# Altium schematic sheet Sheet6.SchDoc
size A4; SheetNumber: 6; SheetTotal: 8; SPICEModelCacheGOSHTQAV: <root> / <DocumentId>GOSHTQAV</DocumentId> / <CacheFrame Number="0"> / <Model Name="max8815a_max8815a_f1" Kind="CKT"> / <Text>**************** / .subckt MAX8815A_MAX8815A_F1 1 2 3 4 / F_MAX8815A_F1         3 4 VF_MAX8815A_F1 -1 / VF_MAX8815A_F1         1 2 0V / .ENDS MAX8815A_MAX8815A_F1</Text> / </Model> / <Model Name="max8815a" Kind="CKT"> / <Text>******************************************************************************* / * Copyright (C) Maxim Integrated Products, Inc., All Rights Reserved. / * / * Permission is hereby granted, free of charge, to any person obtaining a / * copy of this software and associated documentation files (the "Software"), / * to deal in the Software without restriction, including without limitation / * the rights to use, copy, modify, merge, publish, distribute, sublicense, / * and/or sell copies of the Software, and to permit persons to whom the / * Software is furnished to do so, subject to the following conditions: / * / * The above copyright notice and this permission notice shall be included / * in all copies or substantial portions of the Software. / * / * THE SOFTWARE IS PROVIDED "AS IS", WITHOUT WARRANTY OF ANY KIND, EXPRESS / * OR IMPLIED, INCLUDING BUT NOT LIMITED TO THE WARRANTIES OF / * MERCHANTABILITY, FITNESS FOR A PARTICULAR PURPOSE AND NONINFRINGEMENT. / * IN NO EVENT SHALL MAXIM INTEGRATED BE LIABLE FOR ANY CLAIM, DAMAGES / * OR OTHER LIABILITY, WHETHER IN AN ACTION OF CONTRACT, TORT OR OTHERWISE, / * ARISING FROM, OUT OF OR IN CONNECTION WITH THE SOFTWARE OR THE USE OR / * OTHER DEALINGS IN THE SOFTWARE. / * / * Except as contained in this notice, the name of Maxim Integrated / * Products, Inc. shall not be used except as stated in the Maxim Integrated / * Products, Inc. Branding Policy. / * / * The mere transfer of this software does not imply any licenses / * of trade secrets, proprietary technology, copyrights, patents, / * trademarks, maskwork rights, or any other form of intellectual / * property whatsoever. Maxim Integrated Products, Inc. retains all / * ownership rights. / *************************************************************** / * MAX8815A is a 30uA Quiescent Current Step-Up Converter with True Shutdown. / ************************************************************************ / .subckt MAX8815A  LX BATT ON GND FB OUTS SKIPB POUT LX1 POUT1 / *                 |   |   |   |   |   |   |    |    |   | / *                 |   |   |   |   |   |   |    |    |   | / *                 |   |   |   |   |   |   |    |    |   | / *                 |   |   |   |   |   |   |    |    |   | / *                 |   |   |   |   |   |   |    |    |   | / *                 |   |   |   |   |   |   |    |    |   | / *                 |   |   |   |   |   |   |    |    |   Converter Output / *                 |   |   |   |   |   |   |    |    | / *                 |   |   |   |   |   |   |    |    | / *                 |   |   |   |   |   |   |    |    Inductor Connection / *                 |   |   |   |   |   |   |    | / *                 |   |   |   |   |   |   |    | / *                 |   |   |   |   |   |   |    Converter Output / *                 |   |   |   |   |   |   | / *                 |   |   |   |   |   |   | / *                 |   |   |   |   |   |   PWM Mode Selection Input / *                 |   |   |   |   |   | / *                 |   |   |   |   |   | / *                 |   |   |   |   |   Power Bootstrapped Input / *                 |   |   |   |   | / *                 |   |   |   |   | / *                 |   |   |   |    Feedback Input. / *                 |   |   |   | / *                 |   |   |   | / *                 |   |   |   Ground / *                 |   |   | / *                 |   |   | / *                 |   |   Logic On/Off Input. / *                 |   | / *                 |   | / *                 |   Supply Voltage Input / *                 | / *                 | / *                 Inductor Connection / * / * / * Date of model creation: / *		 08/2009 / * / * / * Revision History: / * 		 Version 0 / *        Version 1 / * / * Recommendations: / *     	Use SIMETRIX (or SPICE 2G6; other simulators may require translation) / *     	For a quick, effective design, use a combination of: data sheet / * 	    specs, bench testing, and simulations with this macromodel / *       For Pspice Use .OPTIONS ITL4=30 for resolving convergence / * / * / * Supported: / *	    Heavy Load Switching  , Light Load Switching(Low) , Light Load Switching(High) , Start up , Line Transient ,  Load Transient / *       Results ILX current only match with datashhet value , other parameter do not match. / *       Model works only at temperature of 27 degree celcius / * / * / * / * Not Supported: / *       1. Voltage positioning - not implemented. / *       2. Direct connection of POUT with FB to get 5v output - not implemented / *       3. To change Soft start-time, Reduce the cap Css in the same ratio. Default is 6 ms. / *       4. Model does not take care of the device non-linearity with temperature variations. / * / * / * Known Discrepancies in Model vs. Datasheet: / *       Start_up , Load transient, Line regulation / * / ************************************************* / C_MAX8815A_CSS         GND MAX8815A_VSSR  1n / X_MAX8815A_F1    MAX8815A_N12411433 GND MAX8815A_VCS GND MAX8815A_MAX8815A_F1 / R_MAX8815A_R1         MAX8815A_N123871611 MAX8815A_N12387209  1k / D_MAX8815A_CO1_D2         GND MAX8815A_N12399644 diodemacro_mostideal / G_MAX8815A_CO1_G1         MAX8815A_N12399644 GND MAX8815A_N12473776 / +  MAX8815A_N12618668 -1E6 / D_MAX8815A_CO1_D1         MAX8815A_N12399644 VCC5 diodemacro_mostideal / C_MAX8815A_C7         GND MAX8815A_N12387139  1p / M_MAX8815A_M4         MAX8815A_N12387209 MAX8815A_N123874131 GND GND NJNT L=1u / +  W=2u / E_MAX8815A_EH         MAX8815A_N12419180 GND BATT MAX8815A_N124192281 1E2 / D_MAX8815A_CO2_D2         GND MAX8815A_N12399658 diodemacro_mostideal / G_MAX8815A_CO2_G1         MAX8815A_N12399658 GND MAX8815A_N123994700 / +  MAX8815A_VCS -1E6 / D_MAX8815A_CO2_D1         MAX8815A_N12399658 VCC5 diodemacro_mostideal / V_MAX8815A_V2         MAX8815A_N123994700 GND 1.05V / E_MAX8815A_E2         MAX8815A_N123871611 GND MAX8815A_N12387123 GND 1 / V_MAX8815A_VH         MAX8815A_N124192281 GND 5.5V / C_MAX8815A_C4         GND MAX8815A_N12399658  1n / I_MAX8815A_I10         BATT GND DC 30u / D_MAX8815A_Ds1         MAX8815A_N12473776 VCC5 diodemacro_ideal / I_MAX8815A_I8         GND MAX8815A_SLOPECOM DC 1.26mA / G_MAX8815A_G1         MAX8815A_N12402201 GND MAX8815A_CLKSHT GND -1E3 / V_MAX8815A_VL         MAX8815A_N124192081 GND 1.2V / D_MAX8815A_Ds2         GND MAX8815A_N12473776 diodemacro_ideal / E_MAX8815A_E5         VCC5 GND MAX8815A_N12419028 GND 1 / E_MAX8815A_E29         MAX8815A_N122831242 GND MAX8815A_N12283094 GND 1 / E_MAX8815A_E34         MAX8815A_N127099711 GND MAX8815A_ONRB GND 10000 / I_MAX8815A_I11         ON GND DC 10n / C_MAX8815A_C1         GND MAX8815A_N12402201  1n / C_MAX8815A_C5         GND MAX8815A_N12399644  1n / G_MAX8815A_G5         MAX8815A_SLOPECOM GND MAX8815A_CLKSHT GND 1 / G_MAX8815A_G3         MAX8815A_VSSR GND VCC5 GND -42.1667E-9 / R_MAX8815A_R2         MAX8815A_N12419330 MAX8815A_N12419028  1k / E_MAX8815A_E17         MAX8815A_N12387131 GND MAX8815A_N12387123 / +  MAX8815A_N12387209 1 / R_MAX8815A_Rg         MAX8815A_N126562221 MAX8815A_N12473776  1 / E_MAX8815A_E27         MAX8815A_N122826762 GND MAX8815A_CLK MAX8815A_N12283140 / +  1 / D_MAX8815A_D5         MAX8815A_VSSR MAX8815A_N124769241 diodemacro_ideal / M_MAX8815A_M5         MAX8815A_N12454029 MAX8815A_N127099711 GND GND NJNT L=1u / +  W=20u / G_MAX8815A_G2         MAX8815A_N12402201 GND MAX8815A_N12450689 GND 1E3 / C_MAX8815A_C9         GND MAX8815A_N12450689  1p / E_MAX8815A_E32         MAX8815A_N12618668 MAX8815A_VCS MAX8815A_SLOPECOM GND 1 / V_MAX8815A_VL1         MAX8815A_N124218340 GND 0.5V / D_MAX8815A_D1         MAX8815A_N122826762 MAX8815A_CLKSHT diodemacro_ideal / M_MAX8815A_M3         MAX8815A_N12387139 MAX8815A_N12387131 MAX8815A_N12387123 / +  MAX8815A_N12387123 PMOS L=1u W=570u / M_MAX8815A_M1         LX MAX8815A_N12387139 MAX8815A_N12411433 / +  MAX8815A_N12411433 NJNT L=1u W=12u / M_MAX8815A_M12         MAX8815A_N12419028 MAX8815A_N12419160 GND GND NJNT L=1u / +  W=2u / I_MAX8815A_Ifb         FB GND DC 5nA / R_MAX8815A_R5         GND MAX8815A_CLKSHT  1k / E_MAX8815A_E1         MAX8815A_N12286154 GND FB GND 1 / D_MAX8815A_D3         MAX8815A_N12402201 VCC5 diodemacro_ideal / D_MAX8815A_D7         MAX8815A_SLOPECOM VCC5 diodemacro_ideal / T_MAX8815A_T1         MAX8815A_CLK GND MAX8815A_N12283094 GND Z0=50 TD=10E-9 / D_MAX8815A_D4         GND MAX8815A_N12402201 diodemacro_ideal / M_MAX8815A_M13         MAX8815A_N12419028 MAX8815A_N12419180 GND GND NJNT L=1u / +  W=2u / I_MAX8815A_I14         MAX8815A_N12706191 GND DC 0.1uA / E_MAX8815A_E35         MAX8815A_N12938455 MAX8815A_N12387139 VCC5 / +  MAX8815A_N12387123 1 / C_MAX8815A_C11         GND MAX8815A_N12706191  1p / M_MAX8815A_M2         MAX8815A_N12387139 MAX8815A_N12387131 GND GND NMOS L=1u / +  W=550u / R_MAX8815A_R4         VCC5 MAX8815A_N12454029  1k / M_MAX8815A_NAND2_M4         MAX8815A_NAND2_N6953533 MAX8815A_N12399644 GND GND / +  NMOS L=1u W=2u / M_MAX8815A_NAND2_M1         MAX8815A_N12450689 MAX8815A_N12399658 VCC5 VCC5 / +  PMOS L=1u W=4u / M_MAX8815A_NAND2_M2         MAX8815A_N12450689 MAX8815A_N12399644 VCC5 VCC5 / +  PMOS L=1u W=4u / M_MAX8815A_NAND2_M3         MAX8815A_N12450689 MAX8815A_N12399658 / +  MAX8815A_NAND2_N6953533 GND NMOS L=1u W=2u / D_MAX8815A_D9         MAX8815A_N12706191 POUT diodemacro_ideal / C_MAX8815A_C14         GND OUTS  1p / D_MAX8815A_D8         GND MAX8815A_SLOPECOM diodemacro_ideal / R_MAX8815A_R8         GND MAX8815A_VCS  0.42 / I_MAX8815A_I13         LX GND DC 0.1uA / R_MAX8815A_R6         GND MAX8815A_N12283094  50 / R_MAX8815A_R3         MAX8815A_N12283140 MAX8815A_N122831242  1k / V_MAX8815A_V6         MAX8815A_N12419330 GND 5V / I_MAX8815A_I12         SKIPB GND DC 10n / V_MAX8815A_VL5         MAX8815A_N124769241 GND 1.265V / M_MAX8815A_M14         LX MAX8815A_N12938455 MAX8815A_N12706191 VCC5 PJNT L=1u / +  W=20u / E_MAX8815A_E33         MAX8815A_N126562221 GND MAX8815A_VSSR MAX8815A_N12286154 / +  20 / D_MAX8815A_D2         GND MAX8815A_N12283140 diodemacro_ideal / M_MAX8815A_NAND1_M4         MAX8815A_NAND1_N6953533 MAX8815A_N12402201 GND GND / +  NMOS L=1u W=2u / M_MAX8815A_NAND1_M1         MAX8815A_N123874131 MAX8815A_CLK VCC5 VCC5 PMOS / +  L=1u W=4u / M_MAX8815A_NAND1_M2         MAX8815A_N123874131 MAX8815A_N12402201 VCC5 VCC5 / +  PMOS L=1u W=4u / M_MAX8815A_NAND1_M3         MAX8815A_N123874131 MAX8815A_CLK / +  MAX8815A_NAND1_N6953533 GND NMOS L=1u W=2u / D_MAX8815A_CO3_D2         GND MAX8815A_ONRB diodemacro_mostideal / G_MAX8815A_CO3_G1         MAX8815A_ONRB GND MAX8815A_N124218340 ON -1E6 / D_MAX8815A_CO3_D1         MAX8815A_ONRB VCC5 diodemacro_mostideal / C_MAX8815A_C10         GND MAX8815A_SLOPECOM  1n / D_MAX8815A_D6         GND MAX8815A_VSSR diodemacro_ideal / V_MAX8815A_Vclk         MAX8815A_CLK GND / +PULSE 0 5 1u 1n 1n 0.4375u 0.5u / G_MAX8815A_G4         BATT GND MAX8815A_ONRB GND -5.98E-6 / E_MAX8815A_EL         MAX8815A_N12419160 GND BATT MAX8815A_N124192081 -1E2 / E_MAX8815A_E16         MAX8815A_N12387123 GND MAX8815A_N12454029 GND 1 / .IC         V(MAX8815A_VSSR )=0 / .IC         V(MAX8815A_N12706191 )=0 / ****************** / .model diodemacro_ideal d(n=0.001) / .model diodemacro_mostideal d(IS=1E-12 N=0.000001 BV=35 IBV=1) / .model NJNT nmos(VTO=0.5 KP=50E-2) / .model NMOS nmos(VTO=0.5 KP=100E-6) / .model PMOS pmos(VTO=-0.5 KP=50E-6) / .model PJNT pmos(VTO=-0.5 KP=25E-2) / .ENDS MAX8815A</Text> / <Dependency>0\max8815a_max8815a_f1</Dependency> / </Model> / </CacheFrame> / </root>
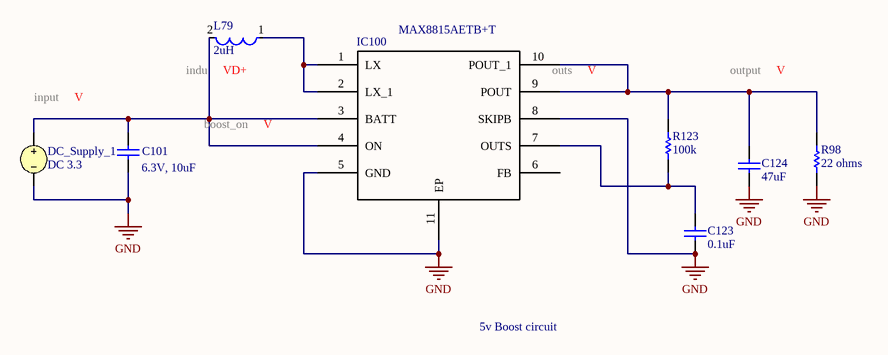
[diagram p0: Sheet6.SchDoc]

## Parts
C101  6.3V, 10uF  [WCAP-CSGP_0603_L1.6W0.8H0.8_Reflow]
C123  value 0.1uF  (hidden comment: Capacitor)
C124  47uF  [CAPC1206(3216)190_N]
DC_Supply_1  DC 3.3
IC100  MAX8815AETB+T  [21-0137I_T1033+2_MXM]
L79  2uH  [FP-NR8040-H_4_2-MFG]
R98  value 22 ohms  (hidden comment: Resistor)
R123  value 100k  (hidden comment: Resistor)

## Nets
GND: C101.1 C123.1 C124.1 DC_Supply_1.2 IC100.5(GND) IC100.8(SKIPB) IC100.11(EP) R98.1
NetC101_2: C101.2 DC_Supply_1.1 IC100.3(BATT) IC100.4(ON) L79.2
NetC123_2: C123.2 IC100.7(OUTS) R123.2
NetC124_2: C124.2 IC100.9(POUT) IC100.10(POUT_1) R98.2 R123.1
NetIC100_1: IC100.1(LX) IC100.2(LX_1) L79.1

Not connected (* = marked no-connect by the designer): IC100 6(FB)

## Notes on the sheet
- 5v Boost circuit

## Library data of the parts
C101 = CMP-03913-53914711-2: Ceramic Capacitor, Multilayer, Ceramic, 6.3V, 20% +Tol, 20% -Tol, X5R, 15% TC, 10uF, Surface Mount, 0603; Capacitance: 10µF; Insulation Resistance: 5MΩ; Value: 10µF; Min Operating Temperature: -55°C; Max Operating Temperature: 85°C; Length: 1.6mm; Mount: Surface Mount; Height: 800µm; Width: 800µm; Case Code (Metric): 1608; RoHS: Compliant; Thickness: 990.6µm; Voltage Rating (DC): 6.3V; Voltage Rating: 6.3V; Case/Package: 0603; REACH SVHC: Unknown; Tolerance: 20%; Case Code (Imperial): 0603; Dielectric: X5R
C123 = Capacitor: SimulationGenericComponent: True
C124 = CMP-1037-04990-1: CAP 22uF 10V ±20% 1206 (3216 Metric) Thickness 1.9mm SMD; Tolerance: Â±20%; Case-EIA: 1206; Case-Metric: 3216; Rated Voltage: 10 V; Max Thickness: 1.9 mm; Technology: SMT; Value: 47uF
DC_Supply_1 = VSRC: Voltage Source; Note: PCB Footprint - Not required; AC Magnitude: 1; AC Phase: 0; Value: 3.3; Published: 8-Jun-2000; LatestRevisionDate: 17-Jul-2002; LatestRevisionNote: Re-released for DXP Platform.; PackageReference: Not Applicable; Publisher: Altium Limited
L79 = CMP-14484-001195-1: Shielded Wirewound Inductor 2uH 30% 7.6A 11.7mΩ SMD; RMS Current (Irms): 6.3A; Test Frequency: 100kHz; Self Resonant Frequency: 50MHz; Max DC Current: 8.1A; DC Resistance (DCR): 11.7mR; Core Material: Ferrite; Length: 8mm; Number of Pins: 2; RoHS Compliant: Yes; Inductance Tolerance: 30%; Max Operating Temperature: 125°C; Min Operating Temperature: -25°C; Shielding: Shielded; Halogen Free: Halogen Free; Tolerance: 30%; Lead Pitch: 5.6mm; Current Rating: 6.3A; Inductance: 2uH; Termination: SMD/SMT; Resistor Type: Wirewound; Packaging: Tape and Reel; Lead Free: Lead Free; Series: NRS; Case/Package: 8040; Package Quantity: 1000; Saturation Current: 8.1A; Height - Seated (Max): 0.157inch; Height: 4mm; Depth: 8.2mm; Width: 0.315inch; Radiation Hardening: No; Mount: Surface Mount; Value: 2uH
R98 R123 = Resistor: TC1: 0; SimulationGenericComponent: True; TC2: 0
IC100 = MAX8815AETB+T: Supplier: DigiKey; Supplier Part Number: MAX8815AETB+TCT-ND